# Altium schematic sheet RaspberryPi.SchDoc
size A3
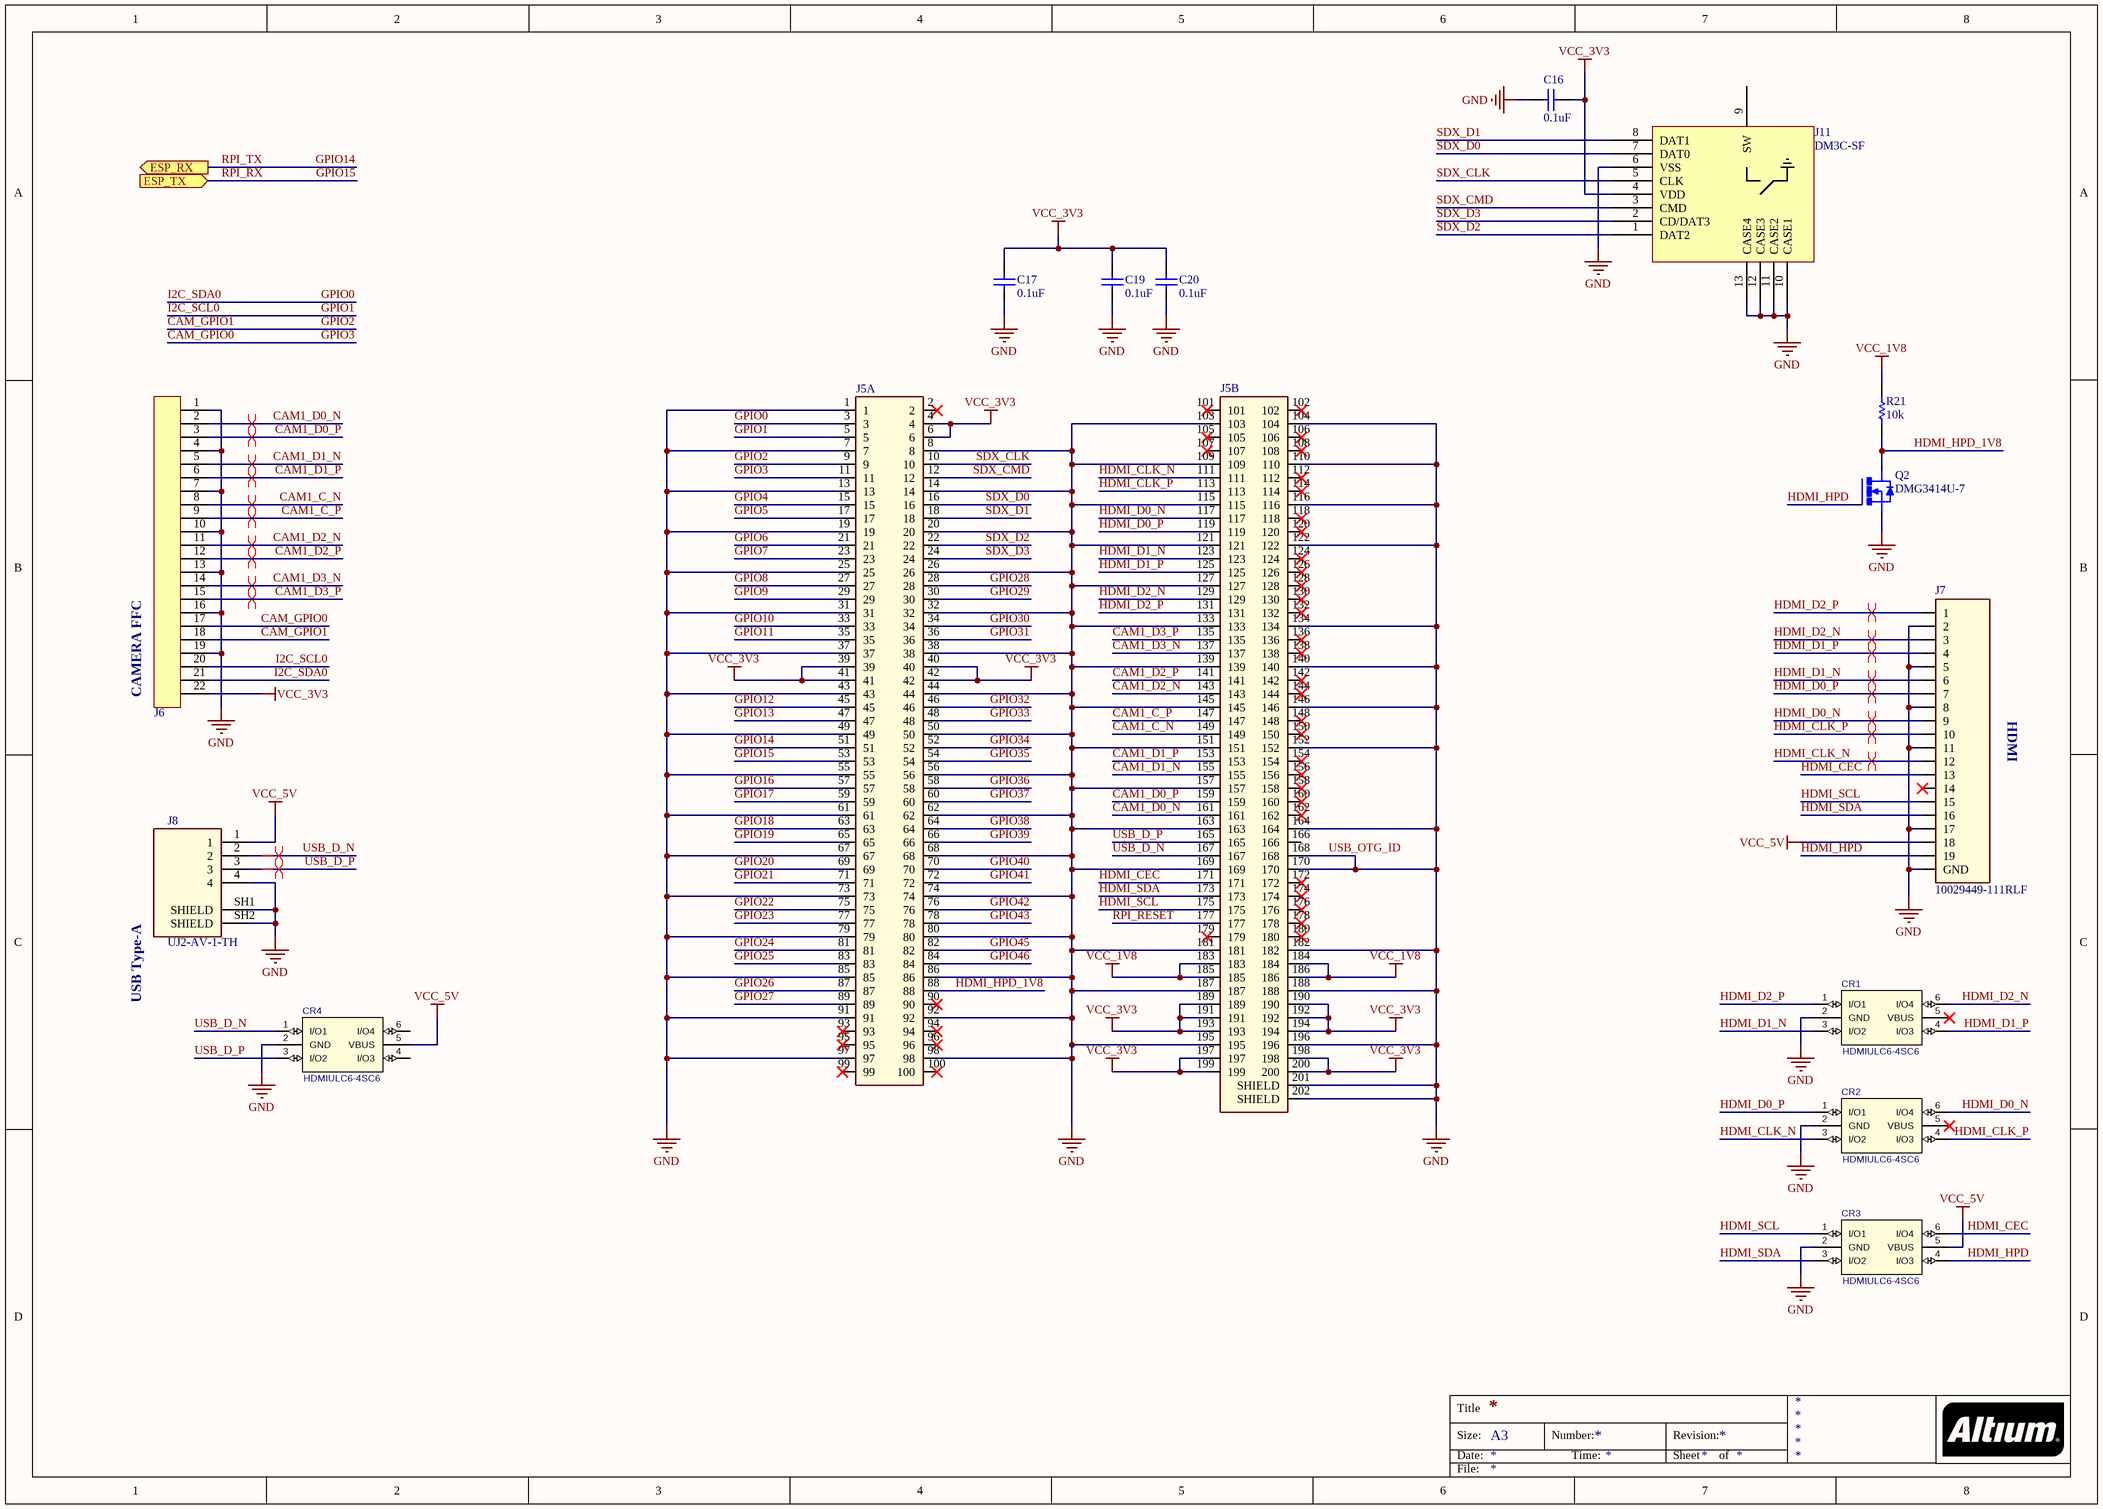
[diagram p0: RaspberryPi.SchDoc]

## Parts
C16  value 0.1uF  [C0603]  (hidden comment: CAP)
C17  value 0.1uF  [C0603]  (hidden comment: CAP)
C19  value 0.1uF  [C0603]  (hidden comment: CAP)
C20  value 0.1uF  [C0603]  (hidden comment: CAP)
CR1  HDMIULC6-4SC6  [SOT23-6L]
CR2  HDMIULC6-4SC6  [SOT23-6L]
CR3  HDMIULC6-4SC6  [SOT23-6L]
CR4  HDMIULC6-4SC6  [SOT23-6L]
J5  1473150-4  [1473005-1]  (value not drawn)  (parts A,B of 2)
J6  5019512210  [5019512210]  (value not drawn)
J7  10029449-111RLF  [10029449-111RLF]
J8  UJ2-AV-1-TH  [UJ2-AV-1-TH]
J11  DM3C-SF  [USD_DM3CS]
Q2  DMG3414U-7  [SOT23-3]
R21  value 10k  [R0603]  (hidden comment: RES)

## Ports
ESP_RX (out), ESP_TX (in)

## Nets
GND: C16.1 C17.2 C19.2 C20.2 CR1.2(GND) CR2.2(GND) CR3.2(GND) CR4.2(GND) J5.1 J5.7 J5.8 J5.13 J5.14 J5.19 J5.20 J5.25 J5.26 J5.31 J5.32 J5.37 J5.38 J5.43 J5.44 J5.49 J5.50 J5.55 J5.56 J5.61 J5.62 J5.67 J5.68 J5.73 J5.74 J5.79 J5.80 J5.85 J5.86 J5.91 J5.92 J5.97 J5.98 J5.103 J5.104 J5.109 J5.110 J5.115 J5.116 J5.121 J5.122 J5.127 J5.133 J5.134 J5.139 J5.140 J5.145 J5.146 J5.151 J5.152 J5.157 J5.163 J5.164 J5.168 J5.169 J5.170 J5.181 J5.182 J5.187 J5.188 J5.195 J5.196 J5.201(SHIELD) J5.202(SHIELD) J6.1 J6.4 J6.7 J6.10 J6.13 J6.16 J6.19 J7.0(GND) J7.2 J7.5 J7.8 J7.11 J7.17 J8.4 J8.SH1(SHIELD) J8.SH2(SHIELD) J11.6(VSS) J11.10(CASE1) J11.11(CASE2) J11.12(CASE3) J11.13(CASE4) Q2.2(S)
VCC_1V8: J5.183 J5.184 J5.185 J5.186 R21.1
VCC_3V3: C16.2 C17.1 C19.1 C20.1 J5.4 J5.6 J5.39 J5.40 J5.41 J5.42 J5.189 J5.190 J5.191 J5.192 J5.193 J5.194 J5.197 J5.198 J5.199 J5.200 J6.22 J11.4(VDD)
VCC_5V: CR3.5(VBUS) CR4.5(VBUS) J7.18 J8.1
CAM1_C_N: J5.149 J6.8
CAM1_C_P: J5.147 J6.9
CAM1_D0_N: J5.161 J6.2
CAM1_D0_P: J5.159 J6.3
CAM1_D1_N: J5.155 J6.5
CAM1_D1_P: J5.153 J6.6
CAM1_D2_N: J5.143 J6.11
CAM1_D2_P: J5.141 J6.12
CAM1_D3_N: J5.137 J6.14
CAM1_D3_P: J5.135 J6.15
CAM_GPIO0: J5.11 J6.17  [also labelled GPIO3]
CAM_GPIO1: J5.9 J6.18  [also labelled GPIO2]
GPIO0: J5.3 J6.21  [also labelled I2C_SDA0]
GPIO1: J5.5 J6.20  [also labelled I2C_SCL0]
GPIO4: J5.15
GPIO5: J5.17
GPIO6: J5.21
GPIO7: J5.23
GPIO8: J5.27
GPIO9: J5.29
GPIO10: J5.33
GPIO11: J5.35
GPIO12: J5.45
GPIO13: J5.47
GPIO14: J5.51 ; port ESP_RX  [also labelled RPI_TX]
GPIO15: J5.53 ; port ESP_TX  [also labelled RPI_RX]
GPIO16: J5.57
GPIO17: J5.59
GPIO18: J5.63
GPIO19: J5.65
GPIO20: J5.69
GPIO21: J5.71
GPIO22: J5.75
GPIO23: J5.77
GPIO24: J5.81
GPIO25: J5.83
GPIO26: J5.87
GPIO27: J5.89
GPIO28: J5.28
GPIO29: J5.30
GPIO30: J5.34
GPIO31: J5.36
GPIO32: J5.46
GPIO33: J5.48
GPIO34: J5.52
GPIO35: J5.54
GPIO36: J5.58
GPIO37: J5.60
GPIO38: J5.64
GPIO39: J5.66
GPIO40: J5.70
GPIO41: J5.72
GPIO42: J5.76
GPIO43: J5.78
GPIO45: J5.82
GPIO46: J5.84
HDMI_CEC: CR3.6(I/O4) J5.171 J7.13
HDMI_CLK_N: CR2.3(I/O2) J5.111 J7.12
HDMI_CLK_P: CR2.4(I/O3) J5.113 J7.10
HDMI_D0_N: CR2.6(I/O4) J5.117 J7.9
HDMI_D0_P: CR2.1(I/O1) J5.119 J7.7
HDMI_D1_N: CR1.3(I/O2) J5.123 J7.6
HDMI_D1_P: CR1.4(I/O3) J5.125 J7.4
HDMI_D2_N: CR1.6(I/O4) J5.129 J7.3
HDMI_D2_P: CR1.1(I/O1) J5.131 J7.1
HDMI_HPD: CR3.4(I/O3) J7.19 Q2.1(G)
HDMI_HPD_1V8: J5.88 Q2.3(D) R21.2
HDMI_SCL: CR3.1(I/O1) J5.175 J7.15
HDMI_SDA: CR3.3(I/O2) J5.173 J7.16
RPI_RESET: J5.177
SDX_CLK: J5.10 J11.5(CLK)
SDX_CMD: J5.12 J11.3(CMD)
SDX_D0: J5.16 J11.7(DAT0)
SDX_D1: J5.18 J11.8(DAT1)
SDX_D2: J5.22 J11.1(DAT2)
SDX_D3: J5.24 J11.2(CD/DAT3)
USB_D_N: CR4.1(I/O1) J5.167 J8.2
USB_D_P: CR4.3(I/O2) J5.165 J8.3

Not connected (* = marked no-connect by the designer): CR1 5(VBUS)*; CR2 5(VBUS)*; CR4 4(I/O3) 6(I/O4); J5 2* 90* 93* 94* 95* 96* 99* 100* 101* 102* 105* 106* 107* 108* 112* 114* 118* 120* 124* 126* 128* 130* 132* 136* 138* 142* 144* 148* 150* 154* 156* 158* 160* 162* 166 172* 174* 176* 178* 179* 180*; J7 14*; J11 9(SW)

## Layout directives
differential pair; differential pair class DIFF: CAM1_C_N, CAM1_C_P, CAM1_D0_N, CAM1_D0_P, CAM1_D1_N, CAM1_D1_P, CAM1_D2_N, CAM1_D2_P, CAM1_D3_N, CAM1_D3_P, HDMI_CLK_N, HDMI_CLK_P, HDMI_D0_N, HDMI_D0_P, HDMI_D1_N, HDMI_D1_P, HDMI_D2_N, HDMI_D2_P, USB_D_N, USB_D_P

## Notes on the sheet
- (near J6) CAMERA FFC
- HDMI
- (near J5) USB_OTG_ID
- USB Type-A
- Title
- Size:
- Date:
- A3
- Number:
- Time:
- Revision:
- Sheet
- of
- File:

## Library data of the parts
C16 C17 C19 C20 = CAP: =Description; Voltage: 25V
CR1-CR4 = HDMIULC6-4SC6: C: Copyright (C) 2015 Accelerated Designs. All rights reserved; Vendor: STMicroelectronics; Built_By: EMA_UL_Team; Value: HDMIULC6-4SC6; Part_Number: HDMIULC6-4SC6
J5 = 1473005-1: CONN SKT SODIMM 200POS R/A SMD DDR2; Number_of_Positions: 200; Centerline_Pitch: .6 mm[.024 in]; MF: TE Connectivity; Product_Type: Socket; MP: 1473150-4; Digi-Key_Purchase_URL: https://www.digikey.com.au/product-detail/en/te-connectivity-amp-connectors/1473005-1/A99605-ND/1890691?utm_source=snapeda&utm_medium=aggregator&utm_campaign=symbol; SnapEDA_Link: https://www.snapeda.com/parts/1473005-1/TE%20Connectivity%20AMP%20Connectors/view-part/?ref=snap; TE_purchase_URL: https://www.te.com/usa-en/product-1473005-1.html?te_bu=Cor&te_type=disp&te_campaign=seda_glo_cor-seda-global-disp-prtnr-fy19-seda-model-bom-cta_sma-317_1&elqCampaignId=32493; Package: None; Digi-Key_Part_Number: A99605-ND; Value: *; Part_Number: 1473150-4
J6 = HDR_1x22: FFC 22 POS VERT; Part_Number: 5019512210
J7 = 10029449-111RLF: CONN RCPT 1.4 HDMI 19POS R/A; Part_Number: 10029449-111RLF
J8 = UJ2-AV-1-TH: Standard A Type 4 Pin Vertical 3 Âµin Plating Through Hole USB Jack 2.0; MF: CUI Inc.; Digi-Key_Part_Number: 102-3995-ND; Digi-Key_Purchase_URL: https://www.digikey.com.au/product-detail/en/cui-inc/UJ2-AV-1-TH/102-3995-ND/6187910?utm_source=snapeda&utm_medium=aggregator&utm_campaign=symbol; Package: None; SnapEDA_Link: https://www.snapeda.com/parts/UJ2-AV-1-TH/CUI%20Inc./view-part/?ref=snap; MP: UJ2-AV-1-TH; CUI_purchase_URL: https://www.cui.com/product/interconnect/usb-connectors/type-a/uj2-av-th-series?utm_source=snapeda.com&utm_medium=referral&utm_campaign=snapedaBOM; Value: *; Part_Number: UJ2-AV-1-TH
J11 = uSD_DM3C-SF: =description; Part_Number: DM3C-SF
Q2 = MOSFET_N_GSD: N Channel MOSFET, SOT23; Part_Number: DMG3414U-7
R21 = RES: =Description